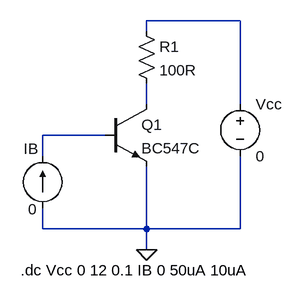
[diagram p0: schematic E2-barridoDC-BC547B.asc]
E2-barridoDC-BC547B.asc, the LTspice schematic file:
Version 4
SHEET 1 880 680
WIRE -1968 -160 -2112 -160
WIRE -2112 -144 -2112 -160
WIRE -2112 -32 -2112 -64
WIRE -1968 -32 -1968 -160
WIRE -2176 16 -2272 16
WIRE -2272 48 -2272 16
WIRE -2272 160 -2272 128
WIRE -2112 160 -2112 64
WIRE -2112 160 -2272 160
WIRE -1968 160 -1968 48
WIRE -1968 160 -2112 160
WIRE -2112 192 -2112 160
FLAG -2112 192 0
SYMBOL npn -2176 -32 R0
SYMATTR InstName Q1
SYMATTR Value BC547C
SYMBOL current -2272 128 R180
WINDOW 0 7 91 Left 2
WINDOW 3 9 -2 Left 2
WINDOW 123 0 0 Left 0
WINDOW 39 0 0 Left 0
SYMATTR InstName IB
SYMATTR Value 0
SYMBOL voltage -1968 -48 R0
WINDOW 123 0 0 Left 0
WINDOW 39 0 0 Left 0
SYMATTR InstName Vcc
SYMATTR Value 0
SYMBOL res -2128 -160 R0
SYMATTR InstName R1
SYMATTR Value 100R
TEXT -2306 224 Left 2 !.dc Vcc 0 12 0.1 IB 0 50uA 10uA

The netlist it stands for:
* E2-barridoDC-BC547B.asc
Q1 N002 N003 0 0 BC547C
IB 0 N003 0
Vcc N001 0 0
R1 N001 N002 100R
.model NPN NPN
.model PNP PNP
.lib standard.bjt
.dc Vcc 0 12 0.1 IB 0 50uA 10uA
.backanno
.end